# Altium schematic sheet Index.SchDoc
size A4
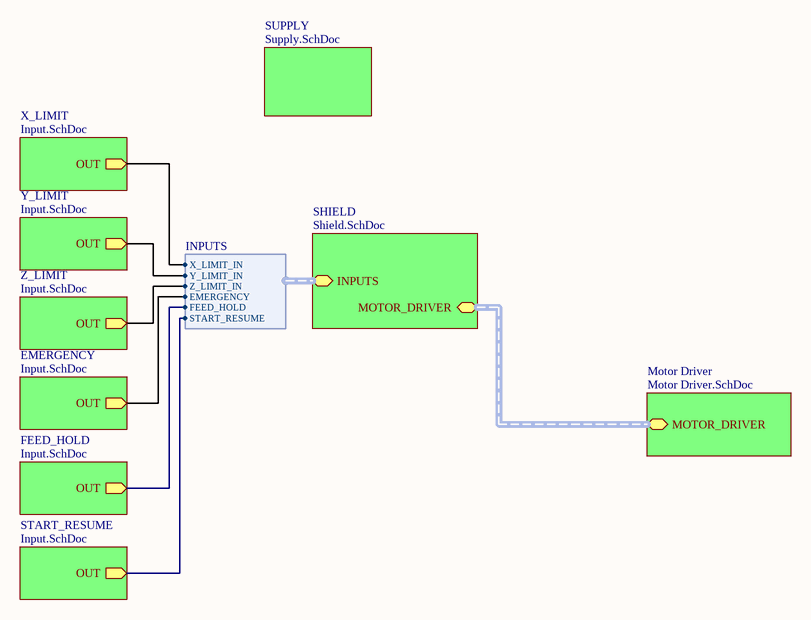
[diagram p0: Index.SchDoc]

## Sub-sheets
EMERGENCY = Input.SchDoc: OUT (out)
FEED_HOLD = Input.SchDoc: OUT (out)
Motor Driver = Motor Driver.SchDoc: MOTOR_DRIVER (harness MOTOR_DRIVER)
SHIELD = Shield.SchDoc: MOTOR_DRIVER (harness MOTOR_DRIVER), INPUTS (harness INPUTS)
START_RESUME = Input.SchDoc: OUT (out)
SUPPLY = Supply.SchDoc: no entries
X_LIMIT = Input.SchDoc: OUT (out)
Y_LIMIT = Input.SchDoc: OUT (out)
Z_LIMIT = Input.SchDoc: OUT (out)

## Harnesses
INPUTS: X_LIMIT_IN, Y_LIMIT_IN, Z_LIMIT_IN, EMERGENCY, FEED_HOLD, START_RESUME

## Nets
(unnamed): sheet X_LIMIT/OUT, sheet SHIELD/INPUTS.X_LIMIT_IN
(unnamed): sheet Z_LIMIT/OUT, sheet SHIELD/INPUTS.Z_LIMIT_IN
(unnamed): sheet EMERGENCY/OUT, sheet SHIELD/INPUTS.EMERGENCY
(unnamed): sheet Y_LIMIT/OUT, sheet SHIELD/INPUTS.Y_LIMIT_IN
(unnamed): sheet FEED_HOLD/OUT, sheet SHIELD/INPUTS.FEED_HOLD
(unnamed): sheet START_RESUME/OUT, sheet SHIELD/INPUTS.START_RESUME

## Buses and harness runs
harness sheet Motor Driver/MOTOR_DRIVER = sheet SHIELD/MOTOR_DRIVER